# Altium schematic sheet Sheet2.SchDoc
size A4
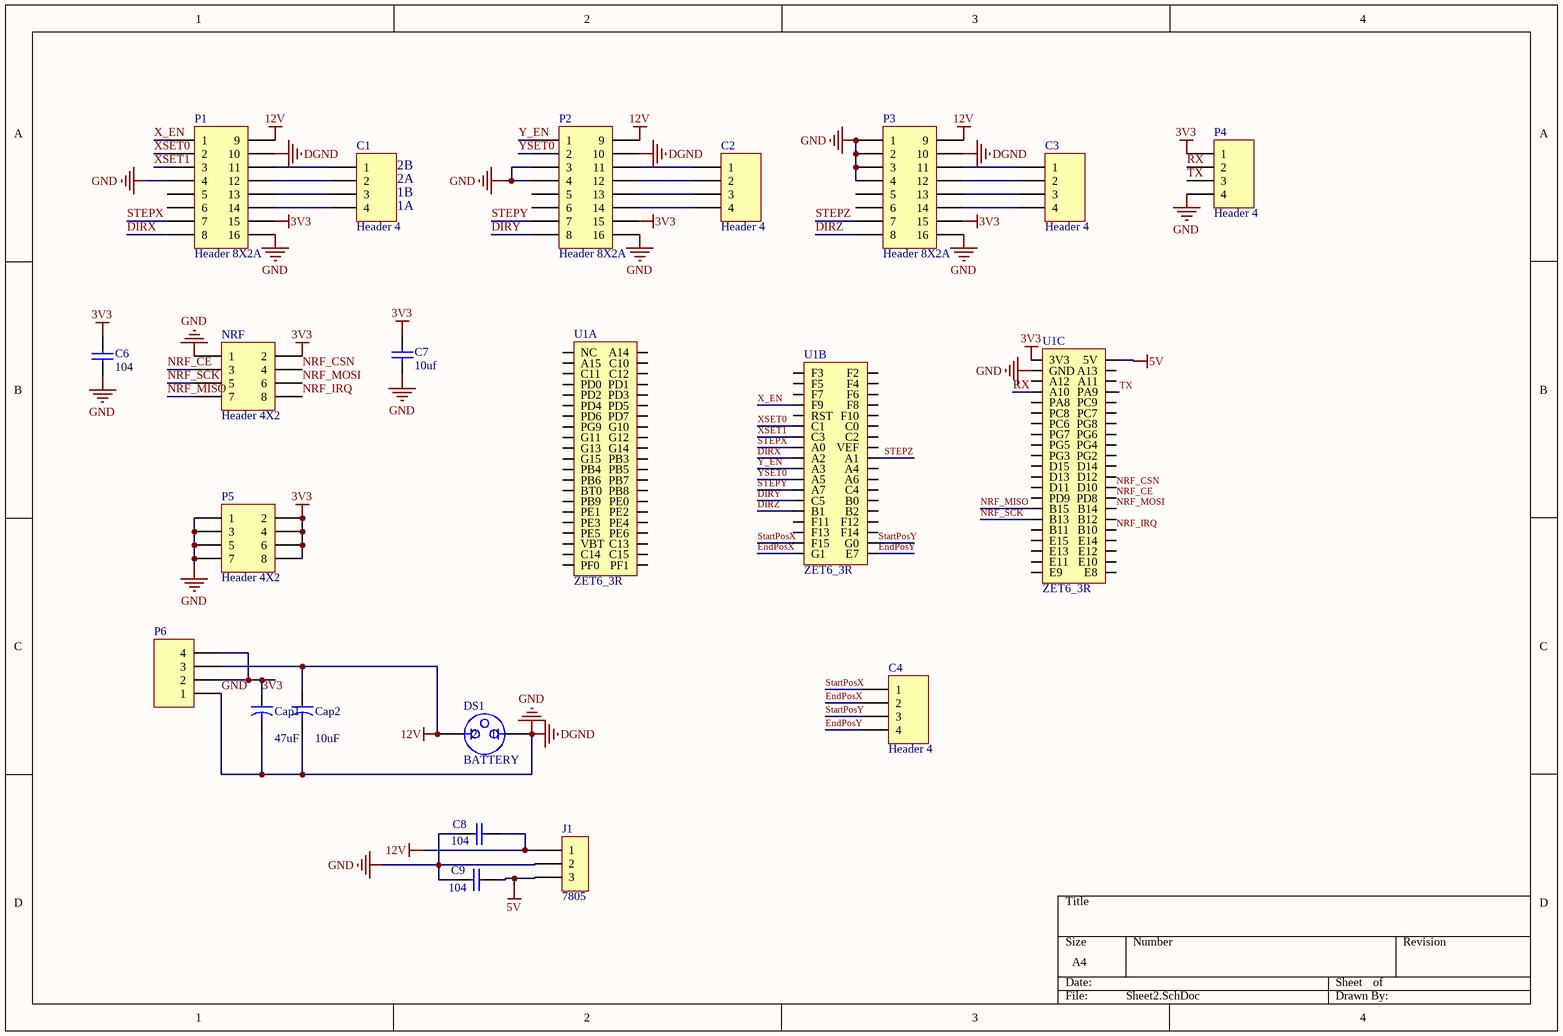
[diagram p0: Sheet2.SchDoc]

## Parts
C1  Header 4  [HDR1X4]
C2  Header 4  [HDR1X4]
C3  Header 4  [HDR1X4]
C4  Header 4  [HDR1X4]
C6  value 104  [0805_C]  (hidden comment: Cap)
C7  value 10uf  [10UF]  (hidden comment: Cap)
C8  value 104  [0805_C]  (hidden comment: Cap)
C9  value 104  [0805_C]  (hidden comment: Cap)
Cap1  value 47uF  [CAPR5-4X5]  (hidden comment: Cap2)
Cap2  value 10uF  [CAPR5-4X5]  (hidden comment: Cap2)
DS1  BATTERY  [9V]
J1  7805  [TO-220]
NRF  Header 4X2  [HDR2X4]
P1  Header 8X2A  [PCBComponent_1]
P2  Header 8X2A  [PCBComponent_1]
P3  Header 8X2A  [PCBComponent_1]
P4  Header 4  [HDR1X4]
P5  Header 4X2  [HDR2X4]
P6  Header 4  [SOT-223]  (value not drawn)
U1  ZET6_3R  [PCBComponent_1]  (parts A,B,C of 3)

## Nets
3V3: C6.1 C7.1 Cap1.1 NRF.2 P1.15 P2.15 P3.15 P4.1 P5.2 P5.4 P5.6 P5.8 P6.2 P6.4 U1.120(3V3)
5V: C9.1 J1.3 U1.119(5V)
12V: C8.2 Cap2.1 DS1.2 J1.1 P1.9 P2.9 P3.9 P6.3
GND: C6.2 C7.2 C8.1 C9.2 Cap1.2 Cap2.2 DS1.1 J1.2 NRF.1 P1.4 P1.10 P1.16 P2.3 P2.4 P2.10 P2.16 P3.1 P3.2 P3.3 P3.4 P3.10 P3.16 P4.4 P5.1 P5.3 P5.5 P5.7 P6.1 U1.118(GND)  [also labelled DGND]
DIRX: P1.8 U1.60(A2)
DIRY: P2.8 U1.68(C5)
DIRZ: P3.8 U1.70(B1)
EndPosX: C4.2 U1.78(G1)
EndPosY: C4.4 U1.77(E7)
NRF_CE: NRF.3 U1.93(PD8)
NRF_CSN: NRF.4 U1.95(D10)
NRF_IRQ: NRF.8 U1.87(B10)
NRF_MISO: NRF.7 U1.92(B15)
NRF_MOSI: NRF.6 U1.91(B14)
NRF_SCK: NRF.5 U1.90(B13)
RX: P4.2 U1.114(A10)
StartPosX: C4.1 U1.76(F15)
StartPosY: C4.3 U1.75(G0)
STEPX: P1.7 U1.58(A0)
STEPY: P2.7 U1.66(A7)
STEPZ: P3.7 U1.59(A1)
TX: P4.3 U1.113(PA9)
X_EN: P1.1 U1.50(F9)
XSET0: P1.2 U1.54(C1)
XSET1: P1.3 U1.56(C3)
Y_EN: P2.1 U1.62(A3)
YSET0: P2.2 U1.64(A5)
NetC1_1: C1.1 P1.11
NetC1_2: C1.2 P1.12
NetC1_3: C1.3 P1.13
NetC1_4: C1.4 P1.14
NetC2_1: C2.1 P2.11
NetC2_2: C2.2 P2.12
NetC2_3: C2.3 P2.13
NetC2_4: C2.4 P2.14
NetC3_1: C3.1 P3.11
NetC3_2: C3.2 P3.12
NetC3_3: C3.3 P3.13
NetC3_4: C3.4 P3.14

Not connected (* = marked no-connect by the designer): P1 5 6; P2 5 6; P3 5 6; U1 1(NC) 2(A14) 3(A15) 4(C10) 5(C11) 6(C12) 7(PD0) 8(PD1) 9(PD2) 10(PD3) 11(PD4) 12(PD5) 13(PD6) 14(PD7) 15(PG9) 16(G10) 17(G11) 18(G12) 19(G13) 20(G14) 21(G15) 22(PB3) 23(PB4) 24(PB5) 25(PB6) 26(PB7) 27(BT0) 28(PB8) 29(PB9) 30(PE0) 31(PE1) 32(PE2) 33(PE3) 34(PE4) 35(PE5) 36(PE6) 37(VBT) 38(C13) 39(C14) 40(C15) 41(PF0) 42(PF1) 43(F2) 44(F3) 45(F4) 46(F5) 47(F6) 48(F7) 49(F8) 51(F10) 52(RST) 53(C0) 55(C2) 57(VEF) 61(A4) 63(A6) 65(C4) 67(B0) 69(B2) 71(F12) 72(F11) 73(F14) 74(F13) 79(E8) 80(E9) 81(E10) 82(E11) 83(E12) 84(E13) 85(E14) 86(E15) 88(B11) 89(B12) 94(PD9) 96(D11) 97(D12) 98(D13) 99(D14) 100(D15) 101(PG2) 102(PG3) 103(PG4) 104(PG5) 105(PG6) 106(PG7) 107(PG8) 108(PC6) 109(PC7) 110(PC8) 111(PC9) 112(PA8) 115(A11) 116(A12) 117(A13)

## Notes on the sheet
- (near C1) 2B
- (near C1) 2A
- (near C1) 1B
- (near C1) 1A

## Library data of the parts
C1-C4 P4 P6 = Header 4: Header, 4-Pin; LatestRevisionDate: 17-Jul-2002; LatestRevisionNote: Re-released for DXP Platform.; Publisher: Altium Limited
C6-C9 = Cap: Capacitor; Published: 8-Jun-2000; LatestRevisionDate: 17-Jul-2002; LatestRevisionNote: Re-released for DXP Platform.; PackageReference: RAD-0.3; Publisher: Altium Limited; PackageDescription: Radial Cap, Thru-Hole; 2 Leads; 0.3 in Pin Spacing
Cap1 Cap2 = Cap2: Capacitor; Published: 23-Sep-2002; PackageReference: CAPR5-4X5; Publisher: Altium Limited; PackageDescription: Capacitor; 2 Leads
J1 = CON3: Connector
NRF P5 = Header 4X2: Header, 4-Pin, Dual row; LatestRevisionDate: 17-Jul-2002; LatestRevisionNote: Re-released for DXP Platform.; Publisher: Altium Limited
P1-P3 = Header 8X2A: Header, 8-Pin, Dual row; LatestRevisionDate: 17-Jul-2002; LatestRevisionNote: Re-released for DXP Platform.; Publisher: Altium Limited